# Altium schematic sheet Display.SchDoc
size A4; SheetNumber: 4; SheetTotal: 4
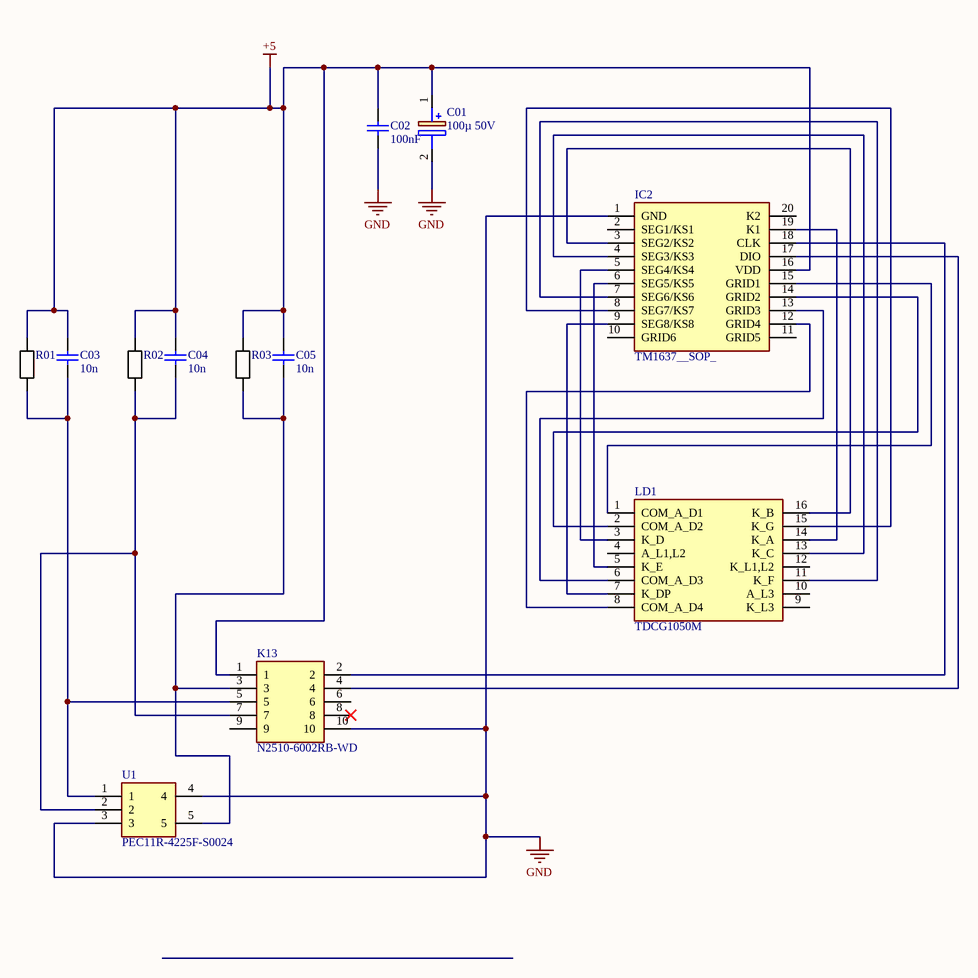
[diagram p0: Display.SchDoc]

## Parts
C01  100µ 50V  [CAPPRD500W65D1025H1250]
C02  100nF  [*CAPC2012X94N]
C03  10n  [LIBRARYSOURCE=Vault]
C04  10n  [LIBRARYSOURCE=Vault]
C05  10n  [LIBRARYSOURCE=Vault]
IC2  TM1637__SOP_  [SOIC127P1045X280-20N]
K13  N2510-6002RB-WD  [N25106002RBWD]
LD1  TDCG1050M  [DIPS1016W75P254L4020H725Q16N]
R01  CRCW08050000Z0EA  [RESC2012X65N]  (value not drawn)
R02  CRCW08050000Z0EA  [RESC2012X65N]  (value not drawn)
R03  CRCW08050000Z0EA  [RESC2012X65N]  (value not drawn)
U1  PEC11R-4225F-S0024  [PEC12R-4XXXF-SXXXX_1]

## Nets
+5: C01.1(+) C02.2 C03.2 C04.2 C05.2 IC2.16(VDD) K13.1 R01.2 R02.2 R03.2
GND: C01.2(-) C02.1 IC2.1(GND) K13.10 U1.3 U1.4
NetC03_1: C03.1 K13.5 R01.1 U1.1
NetC04_1: C04.1 K13.7 R02.1 U1.2
NetC05_1: C05.1 K13.3 R03.1 U1.5
NetIC2_3: IC2.3(SEG2/KS2) LD1.16(K_B)
NetIC2_4: IC2.4(SEG3/KS3) LD1.13(K_C)
NetIC2_5: IC2.5(SEG4/KS4) LD1.3(K_D)
NetIC2_6: IC2.6(SEG5/KS5) LD1.5(K_E)
NetIC2_7: IC2.7(SEG6/KS6) LD1.11(K_F)
NetIC2_8: IC2.8(SEG7/KS7) LD1.15(K_G)
NetIC2_9: IC2.9(SEG8/KS8) LD1.7(K_DP)
NetIC2_12: IC2.12(GRID4) LD1.8(COM_A_D4)
NetIC2_13: IC2.13(GRID3) LD1.6(COM_A_D3)
NetIC2_14: IC2.14(GRID2) LD1.2(COM_A_D2)
NetIC2_15: IC2.15(GRID1) LD1.1(COM_A_D1)
NetIC2_17: IC2.17(DIO) K13.4
NetIC2_18: IC2.18(CLK) K13.2
NetIC2_19: IC2.19(K1) LD1.14(K_A)

Not connected (* = marked no-connect by the designer): IC2 2(SEG1/KS1) 10(GRID6) 11(GRID5) 20(K2); K13 6 8* 9; LD1 4(A_L1,L2) 9(K_L3) 10(A_L3) 12(K_L1,L2)

## Library data of the parts
C01 = B41851A6227M000: Capacitor Polarised; Manufacturer_Name: TDK; Datasheet Link: https://altium.componentsearchengine.com/Datasheets/1/B41851A6227M000.pdf; Height: 12.5mm; Manufacturer_Part_Number: B41851A6227M000; Mouser Part Number: 871-B41851A6227M000; Mouser Price/Stock: http://www.mouser.com/Search/ProductDetail.aspx?qs=DFkWJ3l%252bHdIsXImfYI6EYQ%3d%3d; Arrow Part Number: B41851A6227M000; Arrow Price/Stock: https://www.arrow.com/en/products/b41851a6227m000/epcos-tdk
C02 C03 C04 C05 = CAP: Part Number: 02015A270JAT2A; Manufacturer: AVX Interconnect / Elco
IC2 = TM1637__SOP_: Integrated Circuit; Manufacturer_Name: TITAN MICRO ELECTRONICS; Manufacturer_Part_Number: TM1637 (SOP); Datasheet Link: https://www.mcielectronics.cl/website_MCI/static/documents/Datasheet_TM1637.pdf; Height: 2.8mm
K13 = N2510-6002RB-WD: Connector; Manufacturer_Name: 3M; Datasheet Link: https://componentsearchengine.com/Datasheets/1/N2510-6002RB-WD.pdf; Height: 10.04mm; Manufacturer_Part_Number: N2510-6002RB-WD; Mouser Part Number: 517-N2510-6002RB-WD; Mouser Price/Stock: https://www.mouser.co.uk/ProductDetail/3M-Electronic-Solutions-Division/N2510-6002RB-WD?qs=tSsi4D7a3EKnZz6HvOFNDw%3D%3D; Arrow Part Number: N2510-6002RB-WD; Arrow Price/Stock: https://www.arrow.com/en/products/n2510-6002rb-wd/3m?region=nac
LD1 = TDCG1050M: Display; Manufacturer_Name: Vishay; Datasheet Link: https://www.vishay.com/docs/83180/tdcx10x0m.pdf; Height: 7.25mm; Manufacturer_Part_Number: TDCG1050M; Mouser Part Number: 78-TDCG1050; Mouser Price/Stock: https://www.mouser.co.uk/ProductDetail/Vishay-Semiconductors/TDCG1050M?qs=RzxYCzJDjPUa0IQ9xsk9iw%3D%3D; Arrow Part Number: TDCG1050M; Arrow Price/Stock: https://www.arrow.com/en/products/tdcg1050m/vishay?region=nac
R01 R02 R03 = RES: Manufacturer: Vishay Dale; Part Number: CRCW08050000Z0EA
U1 = PEC11R-4225F-S0024: Undefined or Miscellaneous; Manufacturer_Name: Bourns; Datasheet Link: https://componentsearchengine.com/Datasheets/1/PEC11R-4225F-S0024.pdf; Manufacturer_Part_Number: PEC11R-4225F-S0024; Mouser Part Number: 652-PEC11R-4225F-S24; Mouser Price/Stock: https://www.mouser.co.uk/ProductDetail/Bourns/PEC11R-4225F-S0024?qs=Zq5ylnUbLm4N6UNkPX3pkQ%3D%3D; Arrow Part Number: PEC11R-4225F-S0024; Arrow Price/Stock: https://www.arrow.com/en/products/pec11r-4225f-s0024/bourns?region=nac